# EasyEDA schematic SCH_Roomba esp8266 12F_2022-09-12.json
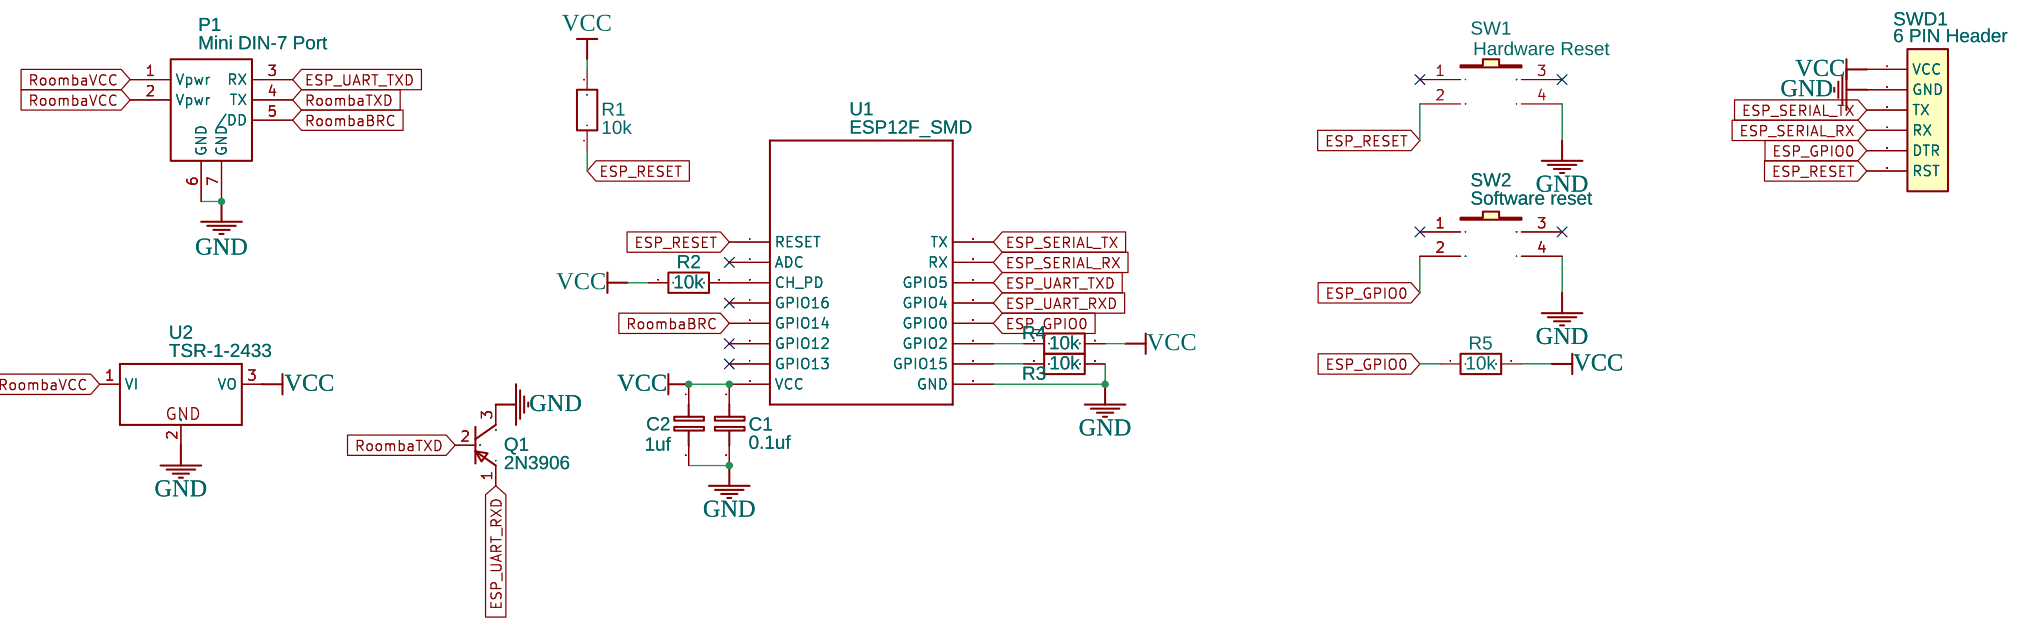
[diagram p0: schematic sheet]

## Parts
C1  0.1uf  [RAD-0.1]
C2  1uf  [RAD-0.1]
P1  Mini DIN-7 Port  [MINI DIN-7]
Q1  2N3906  [TO-92(TO-92-3)]
R1  10k  [R0603]
R2  10k  [R0603]
R3  10k  [R0603]
R4  10k  [R0603]
R5  10k  [R0603]
SW1  Hardware Reset  [SWITCH-6X6X5_TH]
SW2  Software reset  [SWITCH-6X6X5_TH]
SWD1  6 PIN Header  [6_PIN_HEADER_MDG]
U1  ESP12F_SMD  [ESP12F_SMD_MIN]
U2  TSR-1-2433  [TSR-1]

## Library data of the parts
C1 C2 = Capacitor: Manufacturer Part: ?
P1 = Mini DIN-7 Port: Contributor: martinsbl
Q1 = 2N3906: Supplier Part: C9809; Supplier: LCSC; Manufacturer: CJ; image: //image.lceda.cn/szlcsc/C9809.jpg; Contributor: warath
R1-R5 = R_0603_EU: Contributor: LCEDA_Lib
SW1 SW2 = -: EasyEDA: E69330; Supplier Part: E69330; Manufacturer: EasyEDA; Manufacturer Part: SWITCH-6x6x5_TH; Package Display: No
SWD1 = 6 PIN Header: Manufacturer Part: New SchematicLib; Contributor: Bartosz Koziel; Package Display: No
U1 = -: ESP12F Module; Manufacturer Part: ?
U2 = -: sourceId: u2QEepnzx; Manufacturer Part: ?

## Nets
GND: C1.2 C2.2 P1.6(GND) P1.7(GND) Q1.3(C) R3.2 SW1.4 SW2.4 SWD1.2(GND) U1.9(GND) U2.2(GND)
VCC: C1.1 C2.1 R1.2 R2.1 R4.2 R5.2 SWD1.1(VCC) U1.8(VCC) U2.3(VO)
ESP_GPIO0: R5.1 SW2.2 SWD1.5(DTR) U1.12(GPIO0)
ESP_RESET: R1.1 SW1.2 SWD1.6(RST) U1.1(RESET)
ESP_SERIAL_RX: SWD1.4(RX) U1.15(RX)
ESP_SERIAL_TX: SWD1.3(TX) U1.16(TX)
ESP_UART_RXD: Q1.1(E) U1.13(GPIO4)
ESP_UART_TXD: P1.3(RX) U1.14(GPIO5)
RoombaBRC: P1.5(/DD) U1.5(GPIO14)
RoombaTXD: P1.4(TX) Q1.2(B)
RoombaVCC: P1.1(Vpwr) P1.2(Vpwr) U2.1(VI)
Net-(R2-2): R2.2 U1.3(CH_PD)
Net-(R3-1): R3.1 U1.10(GPIO15)
Net-(R4-1): R4.1 U1.11(GPIO2)

Not connected (* = marked no-connect by the designer): SW1 1* 3*; SW2 1* 3*; U1 2(ADC)* 4(GPIO16)* 6(GPIO12)* 7(GPIO13)*
